# EAGLE design rtc (EAGLE 6.4)
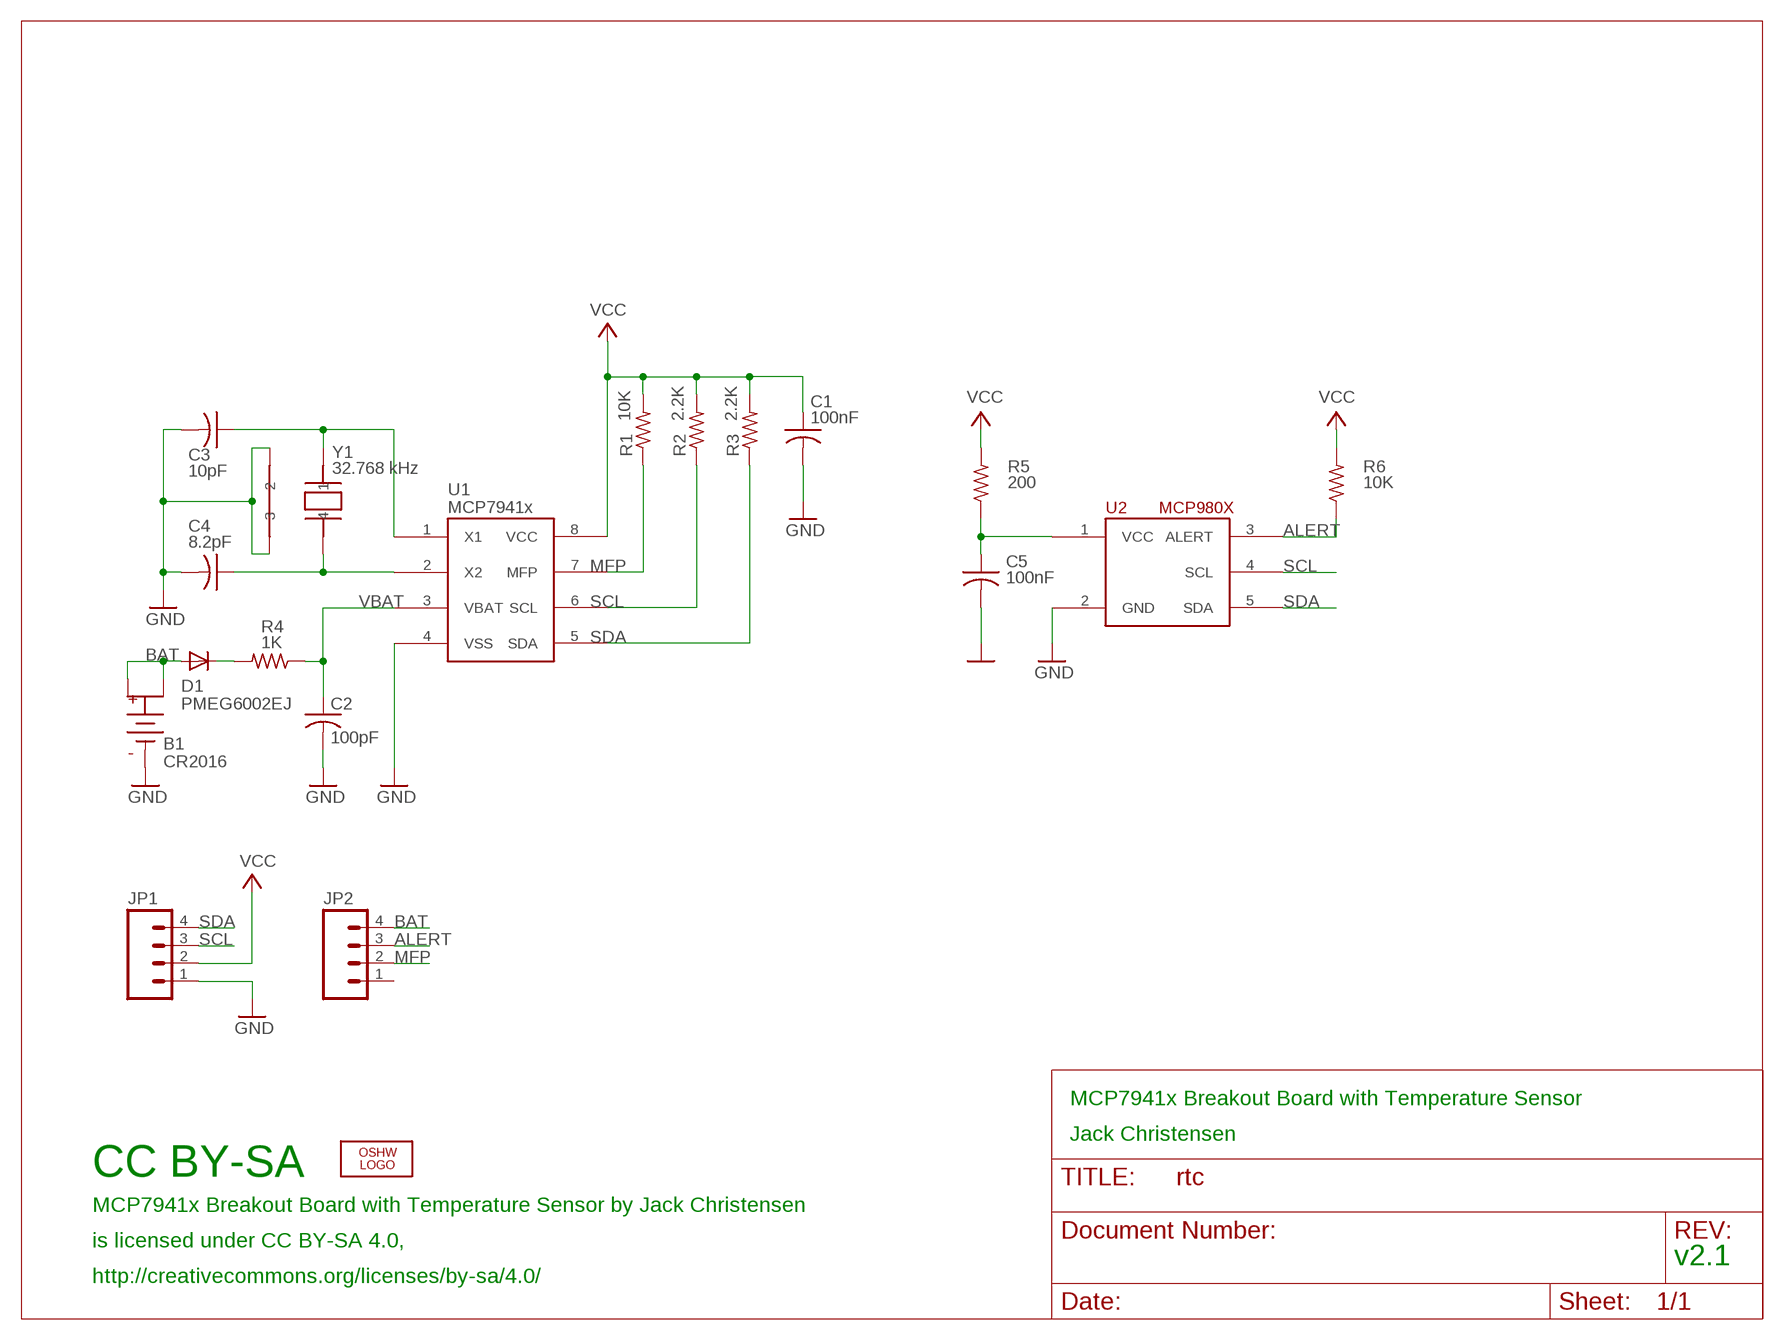
[diagram p0: schematic, sheet 1]

## Parts
B1  CR2016  COIN-CELL-2016-SMT  [BAT-HLD-002-SMT]
C1  100nF  C-USM0805  [M0805]
C2  100pF  C-USM0805  [M0805]
C3  10pF  C-USM0805  [M0805]
C4  8.2pF  C-USM0805  [M0805]
C5  100nF  C-USM0805  [M0805]
D1  PMEG6002EJ  DIODESOD-323F-A  [SOD-323F-A]
JP1  M04LOCK  [1X04_LOCK]
JP2  M04LOCK  [1X04_LOCK]
LOGO2  OSHW_LOGO_8MILX0150-NT  [OSHW_8X150_NOTEXT]
R1  10K  R-US_M0805  [M0805]
R2  2.2K  R-US_M0805  [M0805]
R3  2.2K  R-US_M0805  [M0805]
R4  1K  R-US_M0805  [M0805]
R5  200  R-US_M0805  [M0805]
R6  10K  R-US_M0805  [M0805]
U1  MCP7941x  MCP7941XMSOP8  [MSOP8]
U2  MCP980X  [SOT23-5L]
Y1  32.768 kHz  CRYSTAL-CITIZEN-CM2XXC  [CRYSTAL-CITIZEN-CM2XXC]

## Nets
ALERT: JP2.3 R6.1 U2.3(ALERT)
BAT: B1.POS1 B1.POS2 D1.A JP2.4
GND: B1.NEG(B-) C1.2 C2.2 C3.2 C4.2 C5.2 JP1.1 U1.4(VSS) U2.2(GND) Y1.P$2 Y1.P$3
MFP: JP2.2 R1.1 U1.7(MFP)
N$1: D1.K R4.2
N$2: C4.1 U1.2(X2) Y1.P$4
N$3: C3.1 U1.1(X1) Y1.P$1
N$4: C5.1 R5.1 U2.1(VCC)
SCL: JP1.3 R2.1 U1.6(SCL) U2.4(SCL)
SDA: JP1.4 R3.1 U1.5(SDA) U2.5(SDA)
VBAT: C2.1 R4.1 U1.3(VBAT)
VCC: C1.1 JP1.2 R1.2 R2.2 R3.2 R5.2 R6.2 U1.8(VCC)
Unconnected: JP2.1

## Notes on the sheet
- MCP7941x Breakout Board with Temperature Sensor
- Jack Christensen
- CC BY-SA
- MCP7941x Breakout Board with Temperature Sensor by Jack Christensen
- is licensed under CC BY-SA 4.0,
- v2.1
- http://creativecommons.org/licenses/by-sa/4.0/

## Library data of the parts
B1 = _jc:COIN-CELL
C1-C5 = _jc:C-US: CAPACITOR, American symbol
D1 = _jc:DIODE
JP1 JP2 = SparkFun:M04: Header 4 Standard 4-pin 0.1" header. Use with straight break away headers (SKU : PRT-00116), right angle break away headers (PRT-00553), swiss pins (PRT-00743), machine pins (PRT-00117), and female headers (PRT-00115). Molex polarized connector foot print use with SKU : PRT-08231 with associated crimp pins and housings.
LOGO2 = ohw-logo:OSHW_LOGO_8MIL
R1-R6 = _jc:R-US_: RESISTOR, American symbol
U1 = _jc:MCP7941X
U2 = _jc:MCP980X
Y1 = _jc:CRYSTAL-CITIZEN-CM2XXC

## Board
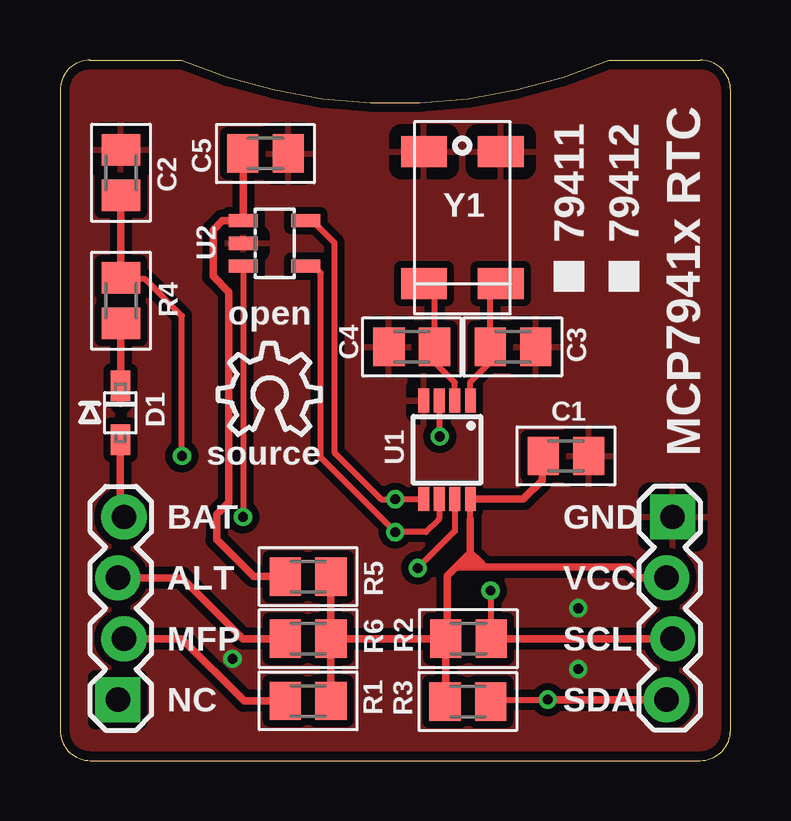
[diagram p1: board, top side]
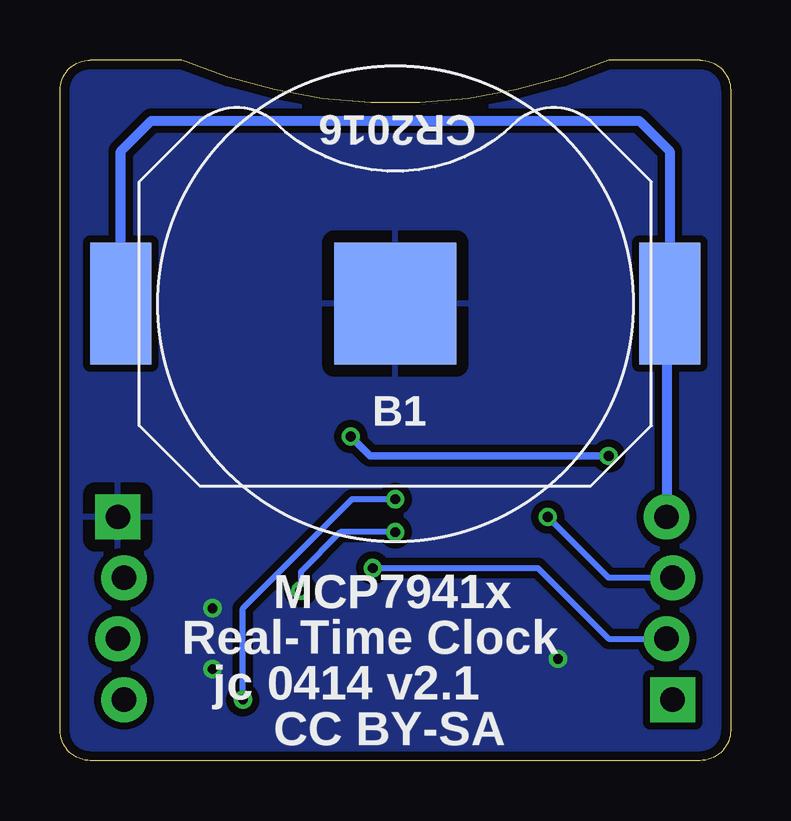
[diagram p2: board, bottom side, seen from below]

Size 27.94 x 29.21 mm. Coordinates in mm from the lower left corner, seen from the top.
Outline: 0,27.94 0,1.27 arc90 1.27,0 26.67,0 arc90 27.94,1.27 27.94,27.94 arc90 26.67,29.21 22.86,29.21 arc-46 5.08,29.21 1.27,29.21 arc90 0,27.94
Copper layers (1*16): Top 0.0356mm / dielectric 1.5011mm / Bottom 0.0356mm
Design rules "LaenPCBOrder_jc1 *": minimum track width 10mil, minimum drill 13mil, track to track 10mil, track to pad 10mil, pad to pad 10mil, via to via 10mil, smd to smd 6mil, copper to edge 15mil, drill to drill 6mil, minimum pad ring 7mil, minimum via ring 7mil, stop-mask expansion 4mil, vias tented up to drill 16mil, thermal gap 20mil

### Footprints (pad centres in the part's own frame; a part is rotated, then mirrored left to right if it is on the bottom)
BAT-HLD-002-SMT = smd 5.08 x 5.08: NEG 0,0 | smd 2.54 x 5.08: POS1 -11.43,0; POS2 11.43,0
M0805 = smd 1.3 x 1.6: 1 -0.95,0; 2 0.95,0
SOD-323F-A = smd 1.27 x 0.813: A -1.118,0; K 1.118,0
1X04_LOCK = drill 1.016 pad 1.88 square: 1 0,0.127 | drill 1.016 pad 1.88: 2 2.54,-0.127; 3 5.08,0.127; 4 7.62,-0.127
MSOP8 = smd 0.45 x 1: 1 -0.975,-2.05; 2 -0.325,-2.05; 3 0.325,-2.05; 4 0.975,-2.05; 5 0.975,2.05; 6 0.325,2.05; 7 -0.325,2.05; 8 -0.975,2.05
SOT23-5L = smd 0.55 x 1.2: 1 -0.95,-1.3; 2 0,-1.3; 3 0.95,-1.3; 4 0.95,1.3; 5 -0.95,1.3
CRYSTAL-CITIZEN-CM2XXC = smd 1.3 x 1.9: P$1 -2.75,-1.6; P$2 2.75,-1.6; P$3 2.75,1.6; P$4 -2.75,1.6

### Placement (x,y rotation side)
B1  13.97,19.05 180 bottom
C1  21.08,12.7 0 top
C2  2.54,24.51 90 top
C3  18.87,17.25 0 top
C4  14.66,17.25 180 top
C5  8.56,25.31 0 top
D1  2.51,14.5 90 top
JP1  25.4,10.16 270 top
JP2  2.54,2.54 90 top
LOGO2  6.6,13.59 0 top
R1  10.34,2.49 0 top
R2  17.02,5.08 180 top
R3  16.99,2.46 180 top
R4  2.54,19.18 270 top
R5  10.34,7.67 0 top
R6  10.34,5.08 0 top
U1  16.13,12.95 180 top
U2  8.94,21.56 270 top
Y1  16.76,22.63 90 top

### Tracks (layer width: path | path; a pad name or v marks a point on that pad's centre or on a via)
ALERT  (via drill 0.41)
  Top 0.254: U2.3 7.64,10.18 v7.62,10.16
  Top 0.305: R6.1 7.62,5.08 5.08,7.62 JP2.3
  Bottom 0.254: JP2.3 5.08,7.62 v7.62,10.16
BAT
  Top 0.305: D1.A 2.52,10.31 JP2.4
  Bottom 0.406: B1.POS2 25.4,25.4 24.13,26.67 3.81,26.67 2.54,25.4 B1.POS1 2.67,18.92 JP2.4
GND  (via drill 0.41)
  other vias: 21.59,3.81 21.59,6.35 7.19,4.24
  pour Bottom (isolate 0.305): -1.27,31.75 33.02,31.75 33.02,-2.54 -1.27,-2.54
  pour Top (isolate 0.305): -2.54,-3.81 33.02,-3.81 33.02,31.75 -2.54,31.75
MFP  (via drill 0.41)
  Top 0.254: U1.7 16.45,9.57 v14.91,8.03
  Top 0.305: R1.1 7.67,2.49 5.08,5.08 JP2.2
  Bottom 0.254: 2.72,5.03 JP2.2 5.08,5.08 8.03,8.03 v14.91,8.03
N$1
  Top 0.305: R4.2 2.54,14.88 D1.K
  Top 0.406: D1.K 2.54,15.21
N$2
  Top 0.254: U1.2 16.45,15.75 15.6,16.61 15.6,17.24 C4.1 15.61,19.44 Y1.P$4
N$3
  Top 0.254: U1.1 17.1,15.78 17.93,16.61 17.93,17.24 C3.1 17.92,19.44 Y1.P$1
N$4
  Top 0.305: R5.1 8.08,7.67 6.53,9.22 6.53,10.26 7.04,10.77 7.04,19.53 6.38,20.19 6.38,22.12 6.77,22.52 U2.1 7.64,25.31 C5.1
SCL  (via drill 0.41)
  Top 0.254: R2.1 17.97,7.05 v17.93,7.09 | U1.6 15.8,10.08 15.24,9.53 v13.97,9.53 10.9,12.6 10.87,12.6 10.87,20.32 10.59,20.6 10.26,20.6 U2.4
  Top 0.305: JP1.3 R2.1
  Bottom 0.254: v13.97,9.53 16.26,9.53 17.91,7.87 17.91,7.11 v17.93,7.09
SDA  (via drill 0.41)
  Top 0.254: U1.5 v13.98,10.9 v13.97,10.9 13.39,10.9 11.43,12.85 11.43,21.59 10.51,22.52 U2.5 | R3.1 18.02,2.54 v20.32,2.54
  Top 0.305: v20.32,2.54 JP1.4
  Bottom 0.254: v20.32,2.54 20.32,6.35 15.77,10.9 v13.97,10.9
VBAT  (via drill 0.41)
  Top 0.254: v15.82,13.51 15.82,14.98 U1.3 | v5.08,12.7 5.08,18.54 3.56,20.07 2.6,20.07 R4.1
  Top 0.305: C2.1 R4.1
  Bottom 0.305: v5.08,12.7 15.01,12.7 v15.82,13.51
VCC
  Top 0.254: 16.05,5.1 R2.2 | 17.09,10.06 U1.8
  Top 0.305: 16.08,2.55 R3.2 16.07,2.49 R2.2 | R6.2 R5.2 | R6.2 R2.2 | R6.2 R1.2 | 17.68,8.08 17.09,8.08 | 17.09,8.08 16.51,8.08 | 16.51,8.08 16.13,7.7 16.13,5.14 R2.2 | 17.09,10.06 17.09,8.66 | 17.09,8.66 17.09,8.08 | U1.8 19.31,10.9 20.09,11.68 20.09,12.66 C1.1 | 16.51,8.08 17.09,8.66 | 17.09,8.66 17.5,8.26 | 17.68,8.08 17.5,8.26 | 17.5,8.26 16.97,8.26 | 17.68,8.08 23.67,8.08 24.13,7.62 JP1.2

### Text on the board
tPlace: 79411 | 79412 | open | source | MCP7941x RTC | BAT | GND | ALT | VCC | MFP | SCL | NC | SDA
bPlace: MCP7941x | Real-Time Clock | jc 0414 v2.1 | CC BY-SA